# Altium schematic sheet DRS4_GPIO_EXPANDER.SchDoc: My title
size A3; Organization: University of California; Address1: 475 Portola Plaza; Address2: Los Angeles, CA 90095; DocumentNumber: 33; Revision: R01; SheetNumber: 33; SheetTotal: 35
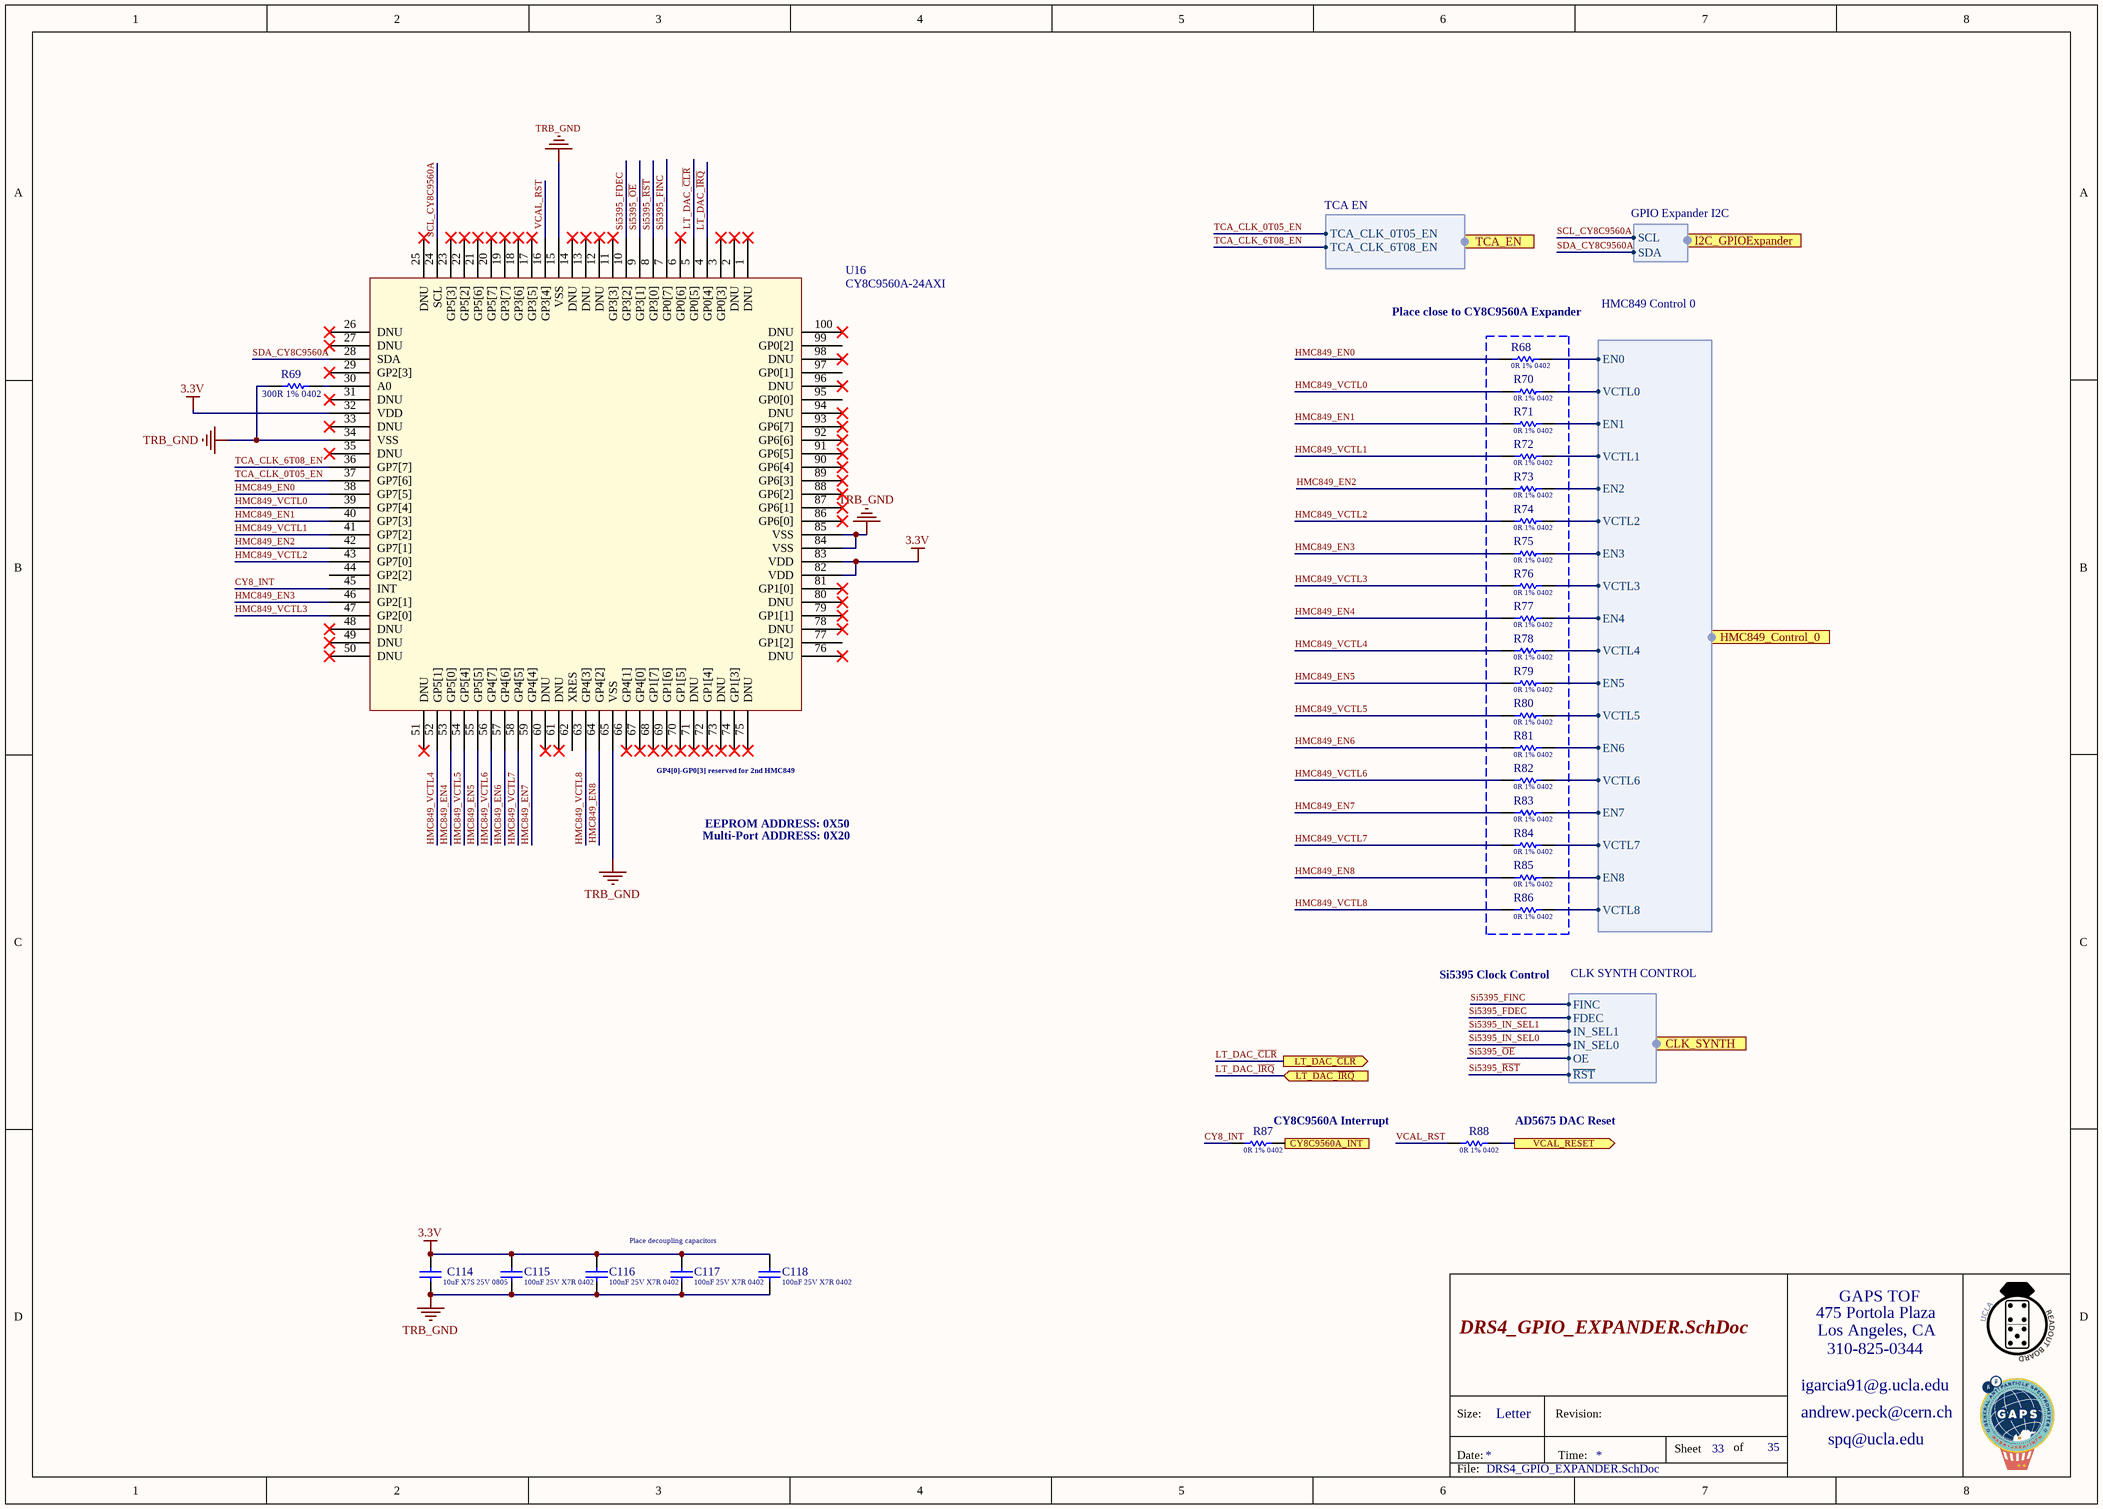
[diagram p0: DRS4_GPIO_EXPANDER.SchDoc]

## Parts
C114  Capacitance: 10uF X7S 25V 0805  [Cap_Murata_ GRM21BC71E106ME11L_10uF]  (hidden comment: Cap_Murata_ GRM21BC71E106ME11L_10uF)
C115  Capacitance: 100nF 25V X7R 0402  [Cap_Taiyo_Yuden_TMK105B7104KV-FR_100nF]  (hidden comment: Cap_Taiyo_Yuden_TMK105B7104KV-FR_100nF)
C116  Capacitance: 100nF 25V X7R 0402  [Cap_Taiyo_Yuden_TMK105B7104KV-FR_100nF]  (hidden comment: Cap_Taiyo_Yuden_TMK105B7104KV-FR_100nF)
C117  Capacitance: 100nF 25V X7R 0402  [Cap_Taiyo_Yuden_TMK105B7104KV-FR_100nF]  (hidden comment: Cap_Taiyo_Yuden_TMK105B7104KV-FR_100nF)
C118  Capacitance: 100nF 25V X7R 0402  [Cap_Taiyo_Yuden_TMK105B7104KV-FR_100nF]  (hidden comment: Cap_Taiyo_Yuden_TMK105B7104KV-FR_100nF)
R68  Resistance: 0R 1% 0402  [Res_Vishay_CRCW04020000Z0EDC_0_Ohm]  (hidden comment: Res_Vishay_CRCW04020000Z0EDC_0_Ohm)
R69  300R 1% 0402  [RESC0402(1005)_L]
R70  Resistance: 0R 1% 0402  [Res_Vishay_CRCW04020000Z0EDC_0_Ohm]  (hidden comment: Res_Vishay_CRCW04020000Z0EDC_0_Ohm)
R71  Resistance: 0R 1% 0402  [Res_Vishay_CRCW04020000Z0EDC_0_Ohm]  (hidden comment: Res_Vishay_CRCW04020000Z0EDC_0_Ohm)
R72  Resistance: 0R 1% 0402  [Res_Vishay_CRCW04020000Z0EDC_0_Ohm]  (hidden comment: Res_Vishay_CRCW04020000Z0EDC_0_Ohm)
R73  Resistance: 0R 1% 0402  [Res_Vishay_CRCW04020000Z0EDC_0_Ohm]  (hidden comment: Res_Vishay_CRCW04020000Z0EDC_0_Ohm)
R74  Resistance: 0R 1% 0402  [Res_Vishay_CRCW04020000Z0EDC_0_Ohm]  (hidden comment: Res_Vishay_CRCW04020000Z0EDC_0_Ohm)
R75  Resistance: 0R 1% 0402  [Res_Vishay_CRCW04020000Z0EDC_0_Ohm]  (hidden comment: Res_Vishay_CRCW04020000Z0EDC_0_Ohm)
R76  Resistance: 0R 1% 0402  [Res_Vishay_CRCW04020000Z0EDC_0_Ohm]  (hidden comment: Res_Vishay_CRCW04020000Z0EDC_0_Ohm)
R77  Resistance: 0R 1% 0402  [Res_Vishay_CRCW04020000Z0EDC_0_Ohm]  (hidden comment: Res_Vishay_CRCW04020000Z0EDC_0_Ohm)
R78  Resistance: 0R 1% 0402  [Res_Vishay_CRCW04020000Z0EDC_0_Ohm]  (hidden comment: Res_Vishay_CRCW04020000Z0EDC_0_Ohm)
R79  Resistance: 0R 1% 0402  [Res_Vishay_CRCW04020000Z0EDC_0_Ohm]  (hidden comment: Res_Vishay_CRCW04020000Z0EDC_0_Ohm)
R80  Resistance: 0R 1% 0402  [Res_Vishay_CRCW04020000Z0EDC_0_Ohm]  (hidden comment: Res_Vishay_CRCW04020000Z0EDC_0_Ohm)
R81  Resistance: 0R 1% 0402  [Res_Vishay_CRCW04020000Z0EDC_0_Ohm]  (hidden comment: Res_Vishay_CRCW04020000Z0EDC_0_Ohm)
R82  Resistance: 0R 1% 0402  [Res_Vishay_CRCW04020000Z0EDC_0_Ohm]  (hidden comment: Res_Vishay_CRCW04020000Z0EDC_0_Ohm)
R83  Resistance: 0R 1% 0402  [Res_Vishay_CRCW04020000Z0EDC_0_Ohm]  (hidden comment: Res_Vishay_CRCW04020000Z0EDC_0_Ohm)
R84  Resistance: 0R 1% 0402  [Res_Vishay_CRCW04020000Z0EDC_0_Ohm]  (hidden comment: Res_Vishay_CRCW04020000Z0EDC_0_Ohm)
R85  Resistance: 0R 1% 0402  [Res_Vishay_CRCW04020000Z0EDC_0_Ohm]  (hidden comment: Res_Vishay_CRCW04020000Z0EDC_0_Ohm)
R86  Resistance: 0R 1% 0402  [Res_Vishay_CRCW04020000Z0EDC_0_Ohm]  (hidden comment: Res_Vishay_CRCW04020000Z0EDC_0_Ohm)
R87  Resistance: 0R 1% 0402  [Res_Vishay_CRCW04020000Z0EDC_0_Ohm]  (hidden comment: Res_Vishay_CRCW04020000Z0EDC_0_Ohm)
R88  Resistance: 0R 1% 0402  [Res_Vishay_CRCW04020000Z0EDC_0_Ohm]  (hidden comment: Res_Vishay_CRCW04020000Z0EDC_0_Ohm)
U16  Series: CY8C9560A-24AXI  [IC_Cypress_Semiconductor_CY8C9560A-24AXI]  (hidden comment: IC_Cypress_Semiconductor_CY8C9560A-24AXI)

## Ports
CLK_SYNTH (harness CLK SYNTH CONTROL), CY8C9560A_INT (out), HMC849_Control_0 (harness HMC849 Control 0), I2C_GPIOExpander (harness GPIO Expander I2C), LT_DAC_~{CLR} (out), LT_DAC_~{IRQ} (in), TCA_EN (harness TCA EN), VCAL_RESET (out)

## Harnesses
HMC849 Control 0: EN0, VCTL0, EN1, VCTL1, EN2, VCTL2, EN3, VCTL3, EN4, VCTL4, EN5, VCTL5, EN6, VCTL6, EN7, VCTL7, EN8, VCTL8
GPIO Expander I2C: SCL, SDA
TCA EN: TCA_CLK_0T05_EN, TCA_CLK_6T08_EN
CLK SYNTH CONTROL: ~{RST}, OE, IN_SEL0, IN_SEL1, FDEC, FINC

## Nets
3.3V: C114.1 C115.2 C116.2 C117.2 C118.2 U16.32(VDD) U16.82(VDD) U16.83(VDD)
TRB_GND: C114.2 C115.1 C116.1 C117.1 C118.1 R69.2 U16.15(VSS) U16.34(VSS) U16.65(VSS) U16.84(VSS) U16.85(VSS)
CY8_INT: R87.2 U16.45(INT)
CY8C9560A_INT: R87.1 ; port CY8C9560A_INT
HMC849_EN0: R68.1 U16.38(GP7[5])
HMC849_EN1: R71.1 U16.40(GP7[3])
HMC849_EN2: R73.1 U16.42(GP7[1])
HMC849_EN3: R75.1 U16.46(GP2[1])
HMC849_EN4: R77.1 U16.53(GP5[0])
HMC849_EN5: R79.1 U16.55(GP5[5])
HMC849_EN6: R81.1 U16.57(GP4[6])
HMC849_EN7: R83.1 U16.59(GP4[4])
HMC849_EN8: R85.1 U16.64(GP4[2])
HMC849_VCTL0: R70.1 U16.39(GP7[4])
HMC849_VCTL1: R72.1 U16.41(GP7[2])
HMC849_VCTL2: R74.1 U16.43(GP7[0])
HMC849_VCTL3: R76.1 U16.47(GP2[0])
HMC849_VCTL4: R78.1 U16.52(GP5[1])
HMC849_VCTL5: R80.1 U16.54(GP5[4])
HMC849_VCTL6: R82.1 U16.56(GP4[7])
HMC849_VCTL7: R84.1 U16.58(GP4[5])
HMC849_VCTL8: R86.1 U16.63(GP4[3])
LT_DAC_~{CLR}: U16.5(GP0[5]) ; port LT_DAC_~{CLR}
LT_DAC_~{IRQ}: U16.4(GP0[4]) ; port LT_DAC_~{IRQ}
SCL_CY8C9560A: U16.24(SCL) ; port I2C_GPIOExpander.SCL
SDA_CY8C9560A: U16.28(SDA) ; port I2C_GPIOExpander.SDA
Si5395_FDEC: U16.10(GP3[2]) ; port CLK_SYNTH.FDEC
Si5395_FINC: U16.7(GP0[7]) ; port CLK_SYNTH.FINC
Si5395_IN_SEL0: port CLK_SYNTH.IN_SEL0
Si5395_IN_SEL1: port CLK_SYNTH.IN_SEL1
Si5395_~{OE}: U16.9(GP3[1]) ; port CLK_SYNTH.OE
Si5395_~{RST}: U16.8(GP3[0]) ; port CLK_SYNTH.~{RST}
TCA_CLK_0T05_EN: U16.37(GP7[6]) ; port TCA_EN.TCA_CLK_0T05_EN
TCA_CLK_6T08_EN: U16.36(GP7[7]) ; port TCA_EN.TCA_CLK_6T08_EN
VCAL_RESET: R88.1 ; port VCAL_RESET
VCAL_RST: R88.2 U16.16(GP3[4])
NetR68_2: R68.2 ; port HMC849_Control_0.EN0
NetR69_1: R69.1 U16.30(A0)
NetR70_2: R70.2 ; port HMC849_Control_0.VCTL0
NetR71_2: R71.2 ; port HMC849_Control_0.EN1
NetR72_2: R72.2 ; port HMC849_Control_0.VCTL1
NetR73_2: R73.2 ; port HMC849_Control_0.EN2
NetR74_2: R74.2 ; port HMC849_Control_0.VCTL2
NetR75_2: R75.2 ; port HMC849_Control_0.EN3
NetR76_2: R76.2 ; port HMC849_Control_0.VCTL3
NetR77_2: R77.2 ; port HMC849_Control_0.EN4
NetR78_2: R78.2 ; port HMC849_Control_0.VCTL4
NetR79_2: R79.2 ; port HMC849_Control_0.EN5
NetR80_2: R80.2 ; port HMC849_Control_0.VCTL5
NetR81_2: R81.2 ; port HMC849_Control_0.EN6
NetR82_2: R82.2 ; port HMC849_Control_0.VCTL6
NetR83_2: R83.2 ; port HMC849_Control_0.EN7
NetR84_2: R84.2 ; port HMC849_Control_0.VCTL7
NetR85_2: R85.2 ; port HMC849_Control_0.EN8
NetR86_2: R86.2 ; port HMC849_Control_0.VCTL8

Not connected (* = marked no-connect by the designer): U16 1(DNU)* 2(DNU)* 3(GP0[3])* 6(GP0[6])* 11(GP3[3])* 12(DNU)* 13(DNU)* 14(DNU)* 17(GP3[5])* 18(GP3[6])* 19(GP3[7])* 20(GP5[7])* 21(GP5[6])* 22(GP5[2])* 23(GP5[3])* 25(DNU)* 26(DNU)* 27(DNU)* 29(GP2[3])* 31(DNU)* 33(DNU)* 35(DNU)* 44(GP2[2]) 48(DNU)* 49(DNU)* 50(DNU)* 51(DNU)* 60(DNU)* 61(DNU)* 62(XRES) 66(GP4[1])* 67(GP4[0])* 68(GP1[7])* 69(GP1[6])* 70(GP1[5])* 71(DNU)* 72(GP1[4])* 73(DNU)* 74(GP1[3])* 75(DNU)* 76(DNU)* 77(GP1[2]) 78(DNU)* 79(GP1[1])* 80(DNU)* 81(GP1[0])* 86(GP6[0])* 87(GP6[1])* 88(GP6[2])* 89(GP6[3])* 90(GP6[4])* 91(GP6[5])* 92(GP6[6])* 93(GP6[7])* 94(DNU)* 95(GP0[0]) 96(DNU)* 97(GP0[1]) 98(DNU)* 99(GP0[2]) 100(DNU)*

## Notes on the sheet
- (near R68) Place close to CY8C9560A Expander
- GP4[0]-GP0[3] reserved for 2nd HMC849
- Multi-Port ADDRESS: 0X20
- EEPROM ADDRESS: 0X50
- Si5395 Clock Control
- (near R87) CY8C9560A Interrupt
- (near R88) AD5675 DAC Reset
- (near C117) Place decoupling capacitors
- 475 Portola Plaza
- GAPS TOF
- igarcia91@g.ucla.edu
- Los Angeles, CA
- 310-825-0344
- Size:
- Date:
- Letter
- Revision:
- Time:
- Sheet
- of
- andrew.peck@cern.ch
- spq@ucla.edu
- File:

## Library data of the parts
C114 = Cap_Murata_ GRM21BC71E106ME11L_10uF: CAP CER 10uF 25V X7R 0805; Supplier 1: Mouser; Supplier Part Number 1: 81-GRM21BC71E106ME1L
C115-C118 = Cap_Taiyo_Yuden_TMK105B7104KV-FR_100nF: CAP CER 100nF 25V X7R 0402; Supplier 1: Mouser; Supplier Part Number 1: 963-TMK105B7104KV-FR
R68 R70-R88 = Res_Vishay_CRCW04020000Z0EDC_0_Ohm: 0R 0.062W 1% 0402 (1005 Metric)  SMD; Supplier 1: Mouser; Supplier Part Number 1: 71-CRCW04020000Z0EDC
R69 = CMP-1011-00449-1: 300R 0.063W 1% 0402 (1005 Metric)  SMD; Case-EIA: 0402; Value: 300.00 Ohm; Case-Metric: 1005; Tolerance: 1 %; Technology: SMT; Power: 0.063 W
U16 = IC_Cypress_Semiconductor_CY8C9560A-24AXI: Interface - I/O Expanders 60BIT IO EXPANDER W/EEPROM; Supplier 1: Mouser; Supplier Part Number 1: 727-CY8C9560A-24AXI